# Altium schematic sheet Battery.SchDoc
size A4
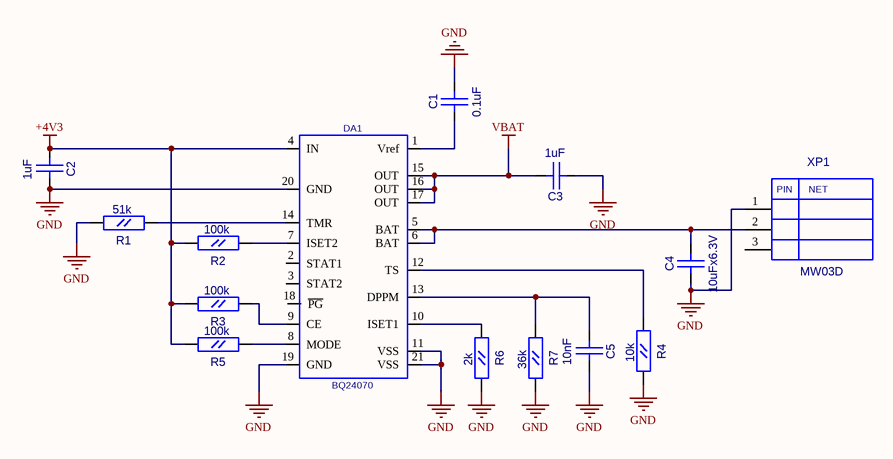
[diagram p0: Battery.SchDoc]

## Parts
C1  0.1uF  [CC0603]
C2  1uF  [CC0603]
C3  1uF  [CC0603]
C4  10uFx6.3V  [CC0805]
C5  10nF  [CC0603]
DA1  BQ24070  [P-PQFP-N20]
R1  51k  [RC0603]
R2  100k  [RC0603]
R3  100k  [RC0603]
R4  10k  [RC0603]
R5  100k  [RC0603]
R6  2k  [RC0603]
R7  36k  [RC0603]
XP1  MW03D  [MW03D]

## Nets
+4V3: C2.1(A) DA1.4(IN) R2.2(B) R3.2(B) R5.2(B)
GND: C1.2(B) C2.2(B) C3.1(A) C4.1(A) C5.2(B) DA1.11(VSS) DA1.19(GND) DA1.20(GND) DA1.21(VSS) R1.2(B) R4.2(B) R6.2(B) R7.2(B) XP1.1
VBAT: C3.2(B) DA1.15(OUT) DA1.16(OUT) DA1.17(OUT)
NetC1_1: C1.1(A) DA1.1(Vref)
NetC4_2: C4.2(B) DA1.5(BAT) DA1.6(BAT) XP1.2
NetC5_1: C5.1(A) DA1.13(DPPM) R7.1(A)
NetDA1_7: DA1.7(ISET2) R2.1(A)
NetDA1_8: DA1.8(MODE) R5.1(A)
NetDA1_9: DA1.9(CE) R3.1(A)
NetDA1_10: DA1.10(ISET1) R6.1(A)
NetDA1_12: DA1.12(TS) R4.1(A)
NetDA1_14: DA1.14(TMR) R1.1(A)

Not connected (* = marked no-connect by the designer): DA1 2(STAT1) 3(STAT2) 18(~{PG}); XP1 3

## Notes on the sheet
- (in symbol MW03D) PIN; NET

## Library data of the parts
C1-C3 C5 = CC0603
  C1: Value: 0.1uF
  C2 C3: Value: 1uF
  C5: Value: 10nF
C4 = CC0805: Value: 10uFx6.3V
R1-R7 = RC0603
  R1: Value: 51k
  R2 R3 R5: Value: 100k
  R4: Value: 10k
  R6: Value: 2k
  R7: Value: 36k
DA1 = BQ24070: Value: *
XP1 = MW03D: Value: *